# EAGLE design MonthCalendar_VL53L0XBreakout_v0.1 (EAGLE 9.4.1)
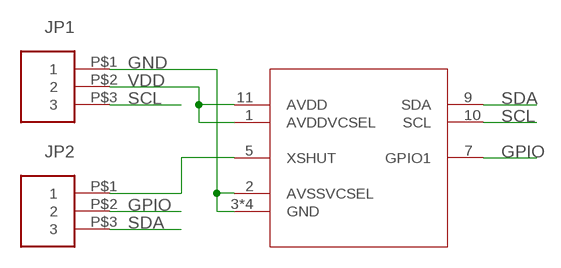
[diagram p0: schematic, sheet 1]

## Parts
JP1  PINHEAD_1X350MIL  [PINHEAD_1X3_50MIL]
JP2  PINHEAD_1X350MIL  [PINHEAD_1X3_50MIL]
U1  VL53L0X  [VL53L0X]

## Nets
GND: JP1.P$1 U1.2(AVSSVCSEL) U1.3(GND) U1.4(GND) U1.6(GND) U1.12(GND)
GPIO: JP2.P$2 U1.7(GPIO1)
SCL: JP1.P$3 U1.10(SCL)
SDA: JP2.P$3 U1.9(SDA)
VDD: JP1.P$2 U1.1(AVDDVCSEL) U1.11(AVDD)
XSHUT: JP2.P$1 U1.5(XSHUT)

## Library data of the parts
JP1 JP2 = MonthCalendar:PINHEAD_1X3: Pin Header - 1 Row, 3 Position
U1 = MonthCalendar:VL53L0X: The VL53L0X is a new generation Time-of-Flight (ToF) laser-ranging module housed in the smallest package on the market today, providing accurate distance measurement whatever the target reflectances unlike conventional technologies. It can measure absolute distances up to 2m, setting a new benchmark in ranging performance levels, opening the door to various new applications. The VL53L0X integrates a leading-edge SPAD array (Single Photon Avalanche Diodes) and embeds ST’s second generation FlightSenseTM patented technology. The VL53L0X’s 940 nm VCSEL emitter (Vertical Cavity Surface-Emitting Laser), is totally invisible to the human eye, coupled with internal physical infrared filters, it enables longer ranging distances, higher immunity to ambient light, and better robustness to cover glass optical crosstalk.

## Board
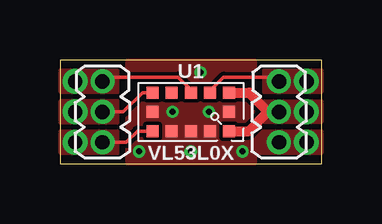
[diagram p1: board, top side]
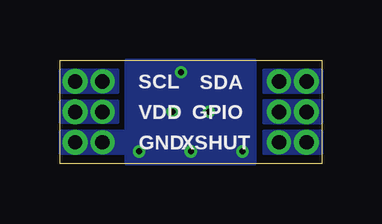
[diagram p2: board, bottom side, seen from below]

Size 10.92 x 4.32 mm. Coordinates in mm from the lower left corner, seen from the top.
Outline: 0,0 10.92,0 10.92,4.32 0,4.32 0,0
Copper layers (1*16): Top 0.035559375mm / dielectric 1.6mm / Bottom 0.035559375mm
Design rules "oshpark-2layer-tented *": minimum track width 6mil, minimum drill 10mil, track to track 6mil, track to pad 6mil, pad to pad 6mil, via to via 6mil, smd to smd 6mil, copper to edge 0mil, drill to drill 6mil, minimum pad ring 5mil, minimum via ring 5mil, stop-mask expansion 2.5mil, vias tented up to drill 20mil, thermal gap 10mil

### Footprints (pad centres in the part's own frame; a part is rotated, then mirrored left to right if it is on the bottom)
PINHEAD_1X3_50MIL = drill 0.6 pad 1: P$1 0,1.27; P$2 0,0; P$3 0,-1.27
VL53L0X = smd 0.5 x 0.5: 1 1.6,-0.8; 2 0.8,-0.8; 3 0,-0.8; 4 -0.8,-0.8; 5 -1.6,-0.8; 6 -1.6,0; 7 -1.6,0.8; 8 -0.8,0.8; 9 0,0.8; 10 0.8,0.8; 11 1.6,0.8; 12 1.6,0

### Placement (x,y rotation side)
JP1  9.14,2.16 180 top
JP2  1.78,2.16 180 top
U1  5.46,2.16 0 top

### Tracks (layer width: path | path; a pad name or v marks a point on that pad's centre or on a via)
GND  (via drill 0.25, 0.6 pad 1.05)
  other vias: 10.29,0.89 5.87,3.81 3.3,0.51 5.46,0.51 7.62,0.51 4.7,2.16 6.22,2.16
  pour Top: 10.92,0.43 8.15,0.43 8.15,1.35 10.92,1.35
  pour Bottom: 10.92,0.43 10.92,1.35 8.15,1.35 8.15,0.43
  pour Bottom: 2.79,4.32 2.79,0 8.15,0 8.15,4.32
  pour Top: 2.79,4.32 2.79,0 8.15,0 8.15,4.32
GPIO  (via drill 0.6 pad 1.05)
  Top 0.152: JP2.P$2 2.64,2.16 3.44,2.96 U1.7
  other vias: 0.64,2.16
  pour Top: 2.41,1.7 2.41,2.62 0,2.62 0,1.7
  pour Bottom: 0,1.7 2.41,1.7 2.41,2.62 0,2.62
SCL  (via drill 0.6 pad 1.05)
  Top 0.152: U1.10 6.29,3.06 6.83,3.61 8.97,3.61 JP1.P$3
  other vias: 10.29,3.43
  pour Bottom: 10.92,2.97 8.51,2.97 8.51,3.89 10.92,3.89
  pour Top (no thermals): 8.51,2.97 10.92,2.97 10.92,3.89 8.51,3.89
SDA  (via drill 0.6 pad 1.05)
  Top 0.152: JP2.P$3 1.96,3.61 4.93,3.61 5.49,3.05 U1.9
  other vias: 0.64,3.43
  pour Bottom: 0,2.97 2.41,2.97 2.41,3.89 0,3.89
  pour Top: 0,2.97 2.41,2.97 2.41,3.89 0,3.89
VDD  (via drill 0.6 pad 1.05)
  Top 0.406: U1.11 7.89,2.96 8.69,2.16 | 8.69,2.16 JP1.P$2 | U1.1 7.89,1.36 8.69,2.16
  other vias: 10.29,2.16
  pour Top: 8.51,2.59 10.92,2.59 10.92,1.73 8.51,1.73
  pour Bottom: 8.51,2.59 8.51,1.73 10.92,1.73 10.92,2.59
XSHUT  (via drill 0.6 pad 1.05)
  Top 0.152: JP2.P$1 2.77,0.89 3.24,1.36 U1.5
  other vias: 0.64,0.89
  pour Top: 0,1.35 2.41,1.35 2.41,0.43 0,0.43
  pour Bottom: 0,1.35 2.41,1.35 2.41,0.43 0,0.43

### Text on the board
bPlace: SDA | SCL | GPIO | VDD | XSHUT | GND